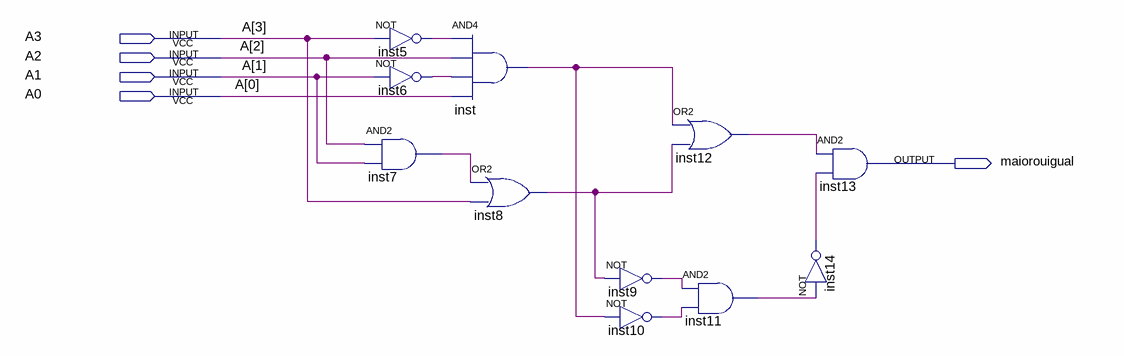
[diagram p0: schematic sheet]
// Quartus schematic com_5.bdf as structural Verilog: 11 symbols, 5 pins
module com_5 (
  input  A3,
  input  A2,
  input  A1,
  input  A0,
  output maiorouigual
);

  wire inst5_out, inst6_out, inst7_out, inst8_out, inst9_out, inst10_out, inst11_out, inst12_out, inst14_out,
       inst_out;

  not inst5 (inst5_out, A3);
  not inst6 (inst6_out, A1);
  and inst7 (inst7_out, A2, A1);
  and inst (inst_out, inst5_out, A2, inst6_out, A0);
  or inst8 (inst8_out, inst7_out, A3);
  not inst9 (inst9_out, inst8_out);
  not inst10 (inst10_out, inst_out);
  or inst12 (inst12_out, inst_out, inst8_out);
  and inst11 (inst11_out, inst9_out, inst10_out);
  and inst13 (maiorouigual, inst12_out, inst14_out);
  not inst14 (inst14_out, inst11_out);
endmodule
